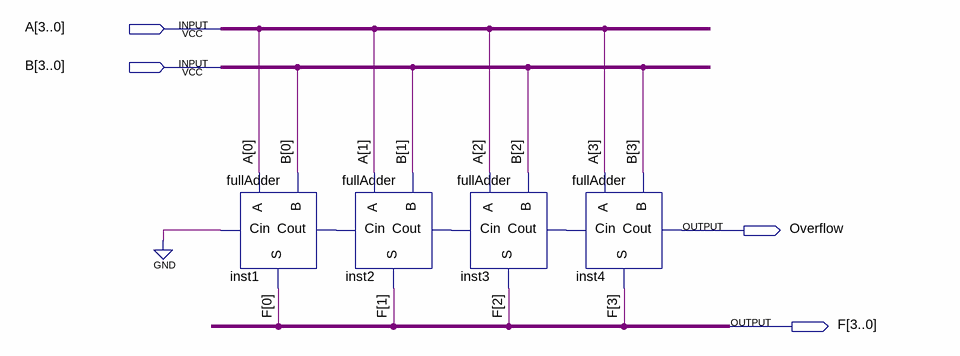
[diagram p0: schematic sheet]
// Quartus schematic Somador4Bits.bdf as structural Verilog: 4 symbols, 4 pins
module Somador4Bits (
  input  [3:0] A,
  input  [3:0] B,
  output Overflow,
  output [3:0] F
);

  wire inst1_cout, inst2_cout, inst3_cout;

  fullAdder inst1 (.A(A[0]), .B(B[0]), .Cin(1'b0), .S(F[0]), .Cout(inst1_cout));
  fullAdder inst2 (.A(A[1]), .B(B[1]), .Cin(inst1_cout), .S(F[1]), .Cout(inst2_cout));
  fullAdder inst3 (.A(A[2]), .B(B[2]), .Cin(inst2_cout), .S(F[2]), .Cout(inst3_cout));
  fullAdder inst4 (.A(A[3]), .B(B[3]), .Cin(inst3_cout), .S(F[3]), .Cout(Overflow));
endmodule
